# EAGLE schematic accra_conditioner (EAGLE 6.6.0)
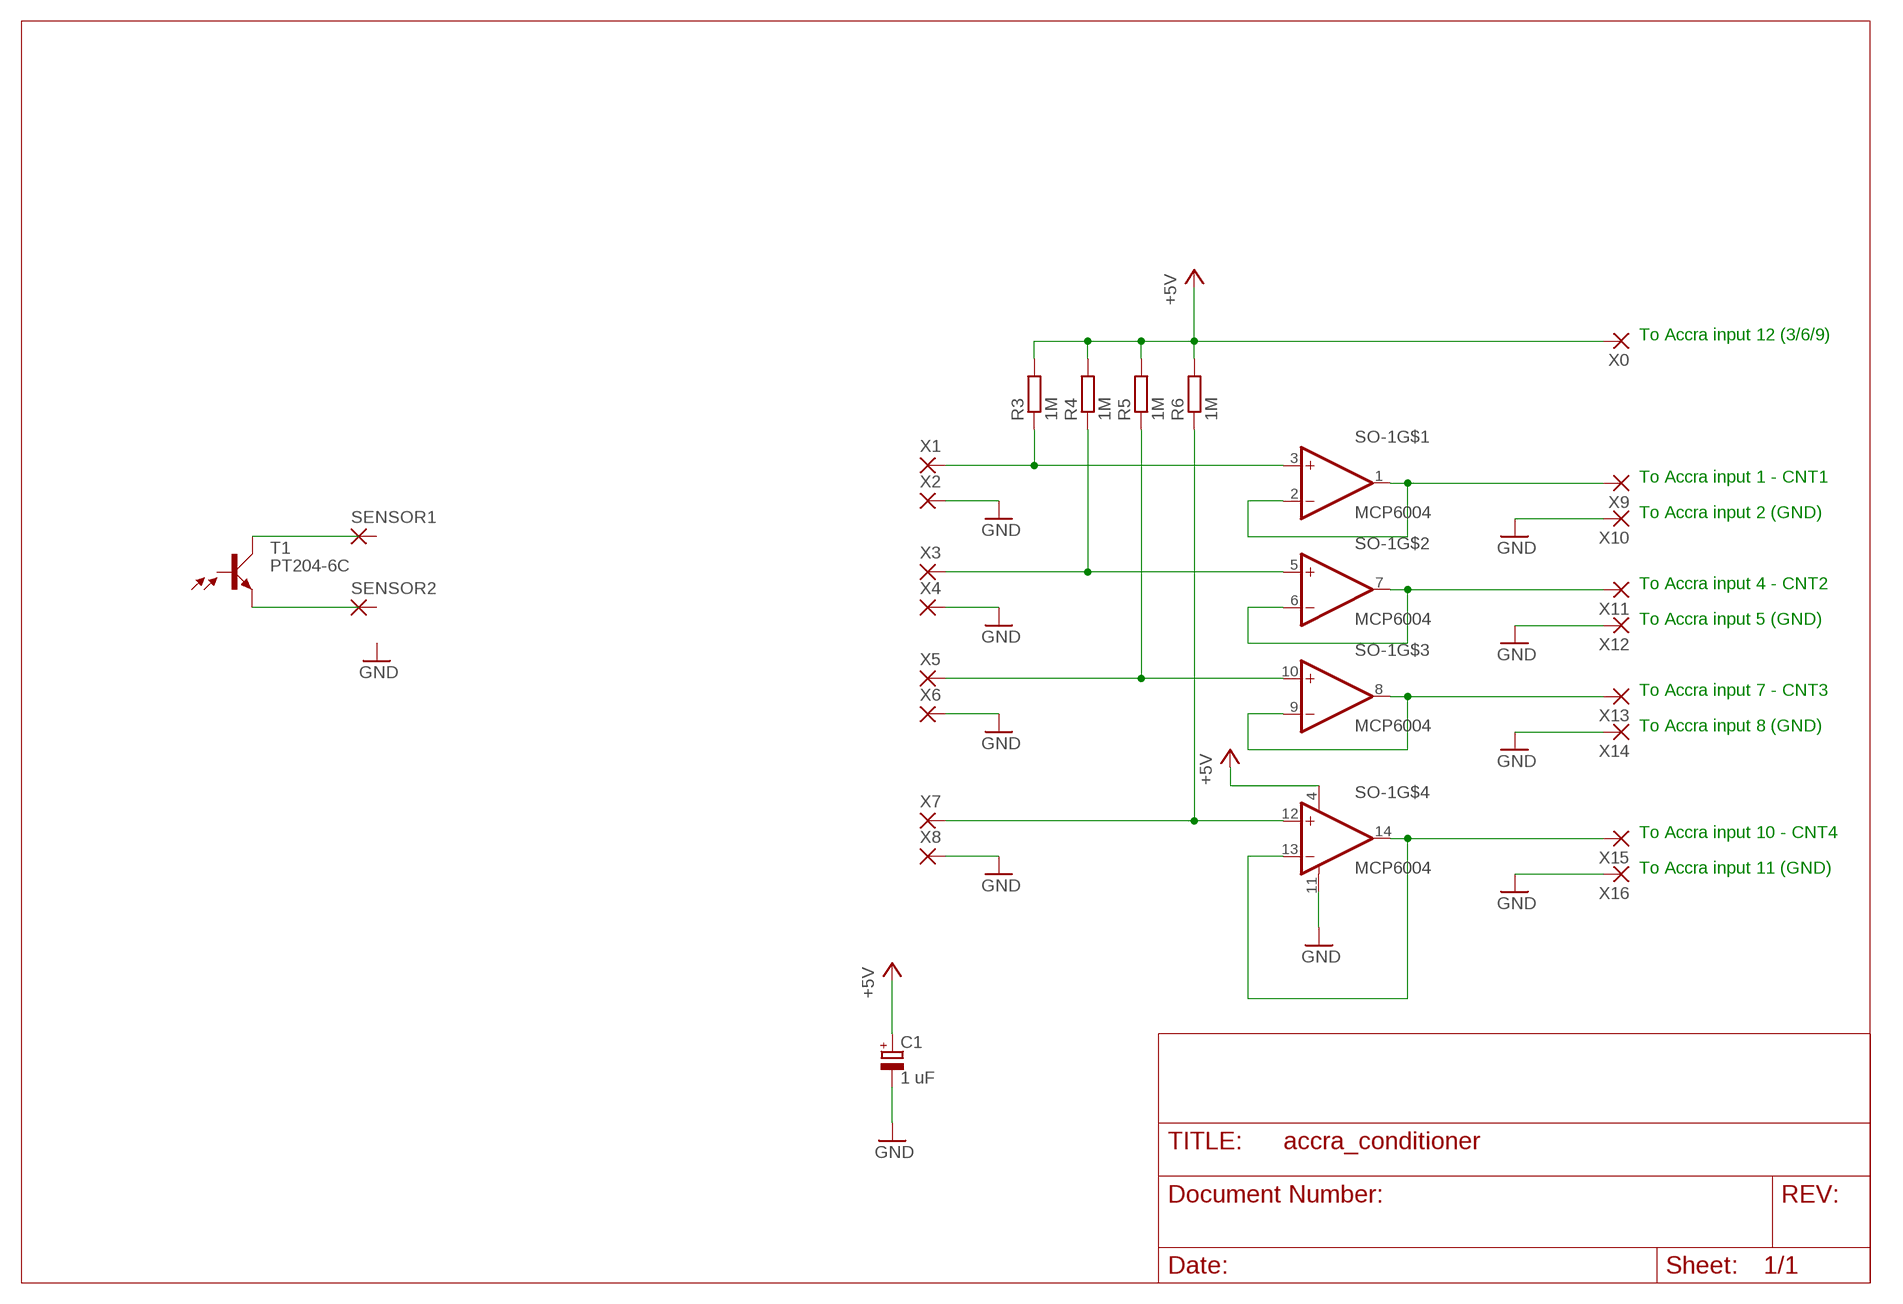
[diagram p0: schematic, sheet 1]

## Parts
C1  1 uF  CPOL-EUE2.5-5  [E2,5-5]
R3  1M  R-EU_0207/10  [0207/10]
R4  1M  R-EU_0207/10  [0207/10]
R5  1M  R-EU_0207/10  [0207/10]
R6  1M  R-EU_0207/10  [0207/10]
SENSOR1  WIREPAD1,6/0,8  [1,6/0,8]
SENSOR2  WIREPAD1,6/0,8  [1,6/0,8]
SO-1  MCP6004  [SO-14]
T1  PT204-6C  BP103  [BP103]
X0  WIREPAD1,6/0,8  [1,6/0,8]
X1  WIREPAD1,6/0,8  [1,6/0,8]
X2  WIREPAD1,6/0,8  [1,6/0,8]
X3  WIREPAD1,6/0,8  [1,6/0,8]
X4  WIREPAD1,6/0,8  [1,6/0,8]
X5  WIREPAD1,6/0,8  [1,6/0,8]
X6  WIREPAD1,6/0,8  [1,6/0,8]
X7  WIREPAD1,6/0,8  [1,6/0,8]
X8  WIREPAD1,6/0,8  [1,6/0,8]
X9  WIREPAD1,6/0,8  [1,6/0,8]
X10  WIREPAD1,6/0,8  [1,6/0,8]
X11  WIREPAD1,6/0,8  [1,6/0,8]
X12  WIREPAD1,6/0,8  [1,6/0,8]
X13  WIREPAD1,6/0,8  [1,6/0,8]
X14  WIREPAD1,6/0,8  [1,6/0,8]
X15  WIREPAD1,6/0,8  [1,6/0,8]
X16  WIREPAD1,6/0,8  [1,6/0,8]

## Nets
+5V: C1.+ R3.2 R4.2 R5.2 R6.2 SO-1.4(V+) X0.1(P)
GND: C1.- SO-1.11(V-) X2.1(P) X4.1(P) X6.1(P) X8.1(P) X10.1(P) X12.1(P) X14.1(P) X16.1(P)
N$1: T1.C
N$2: R3.1 SO-1.3(+IN) X1.1(P)
N$3: R4.1 SO-1.5(+IN) X3.1(P)
N$4: T1.E
N$5: SO-1.1(OUT) SO-1.2(-IN) X9.1(P)
N$6: SO-1.6(-IN) SO-1.7(OUT) X11.1(P)
N$7: R5.1 SO-1.10(+IN) X5.1(P)
N$8: R6.1 SO-1.12(+IN) X7.1(P)
N$9: SO-1.8(OUT) SO-1.9(-IN) X13.1(P)
N$10: SO-1.13(-IN) SO-1.14(OUT) X15.1(P)
Unconnected: SENSOR1.1(P) SENSOR2.1(P) T1.B

## Notes on the sheet
- To Accra input 12 (3/6/9)
- To Accra input 1 - CNT1
- To Accra input 2 (GND)
- To Accra input 4 - CNT2
- To Accra input 5 (GND)
- To Accra input 7 - CNT3
- To Accra input 8 (GND)
- To Accra input 10 - CNT4
- To Accra input 11 (GND)

## Library data of the parts
C1 = rcl:CPOL-EU: POLARIZED CAPACITOR, European symbol
R3-R6 = rcl:R-EU_: RESISTOR, European symbol
SENSOR1 SENSOR2 X0 X1-X16 = wirepad:WIREPAD: Wire PAD connect wire on PCB
SO-1 = eurosource_microchip_opamp:MCP6004
T1 = opto-trans-siemens:BP103: PHOTO TRANSISTOR; OC_FARNELL: unknown; OC_NEWARK: unknown